# EAGLE design motorsturing_v2 (EAGLE 9.6.2)
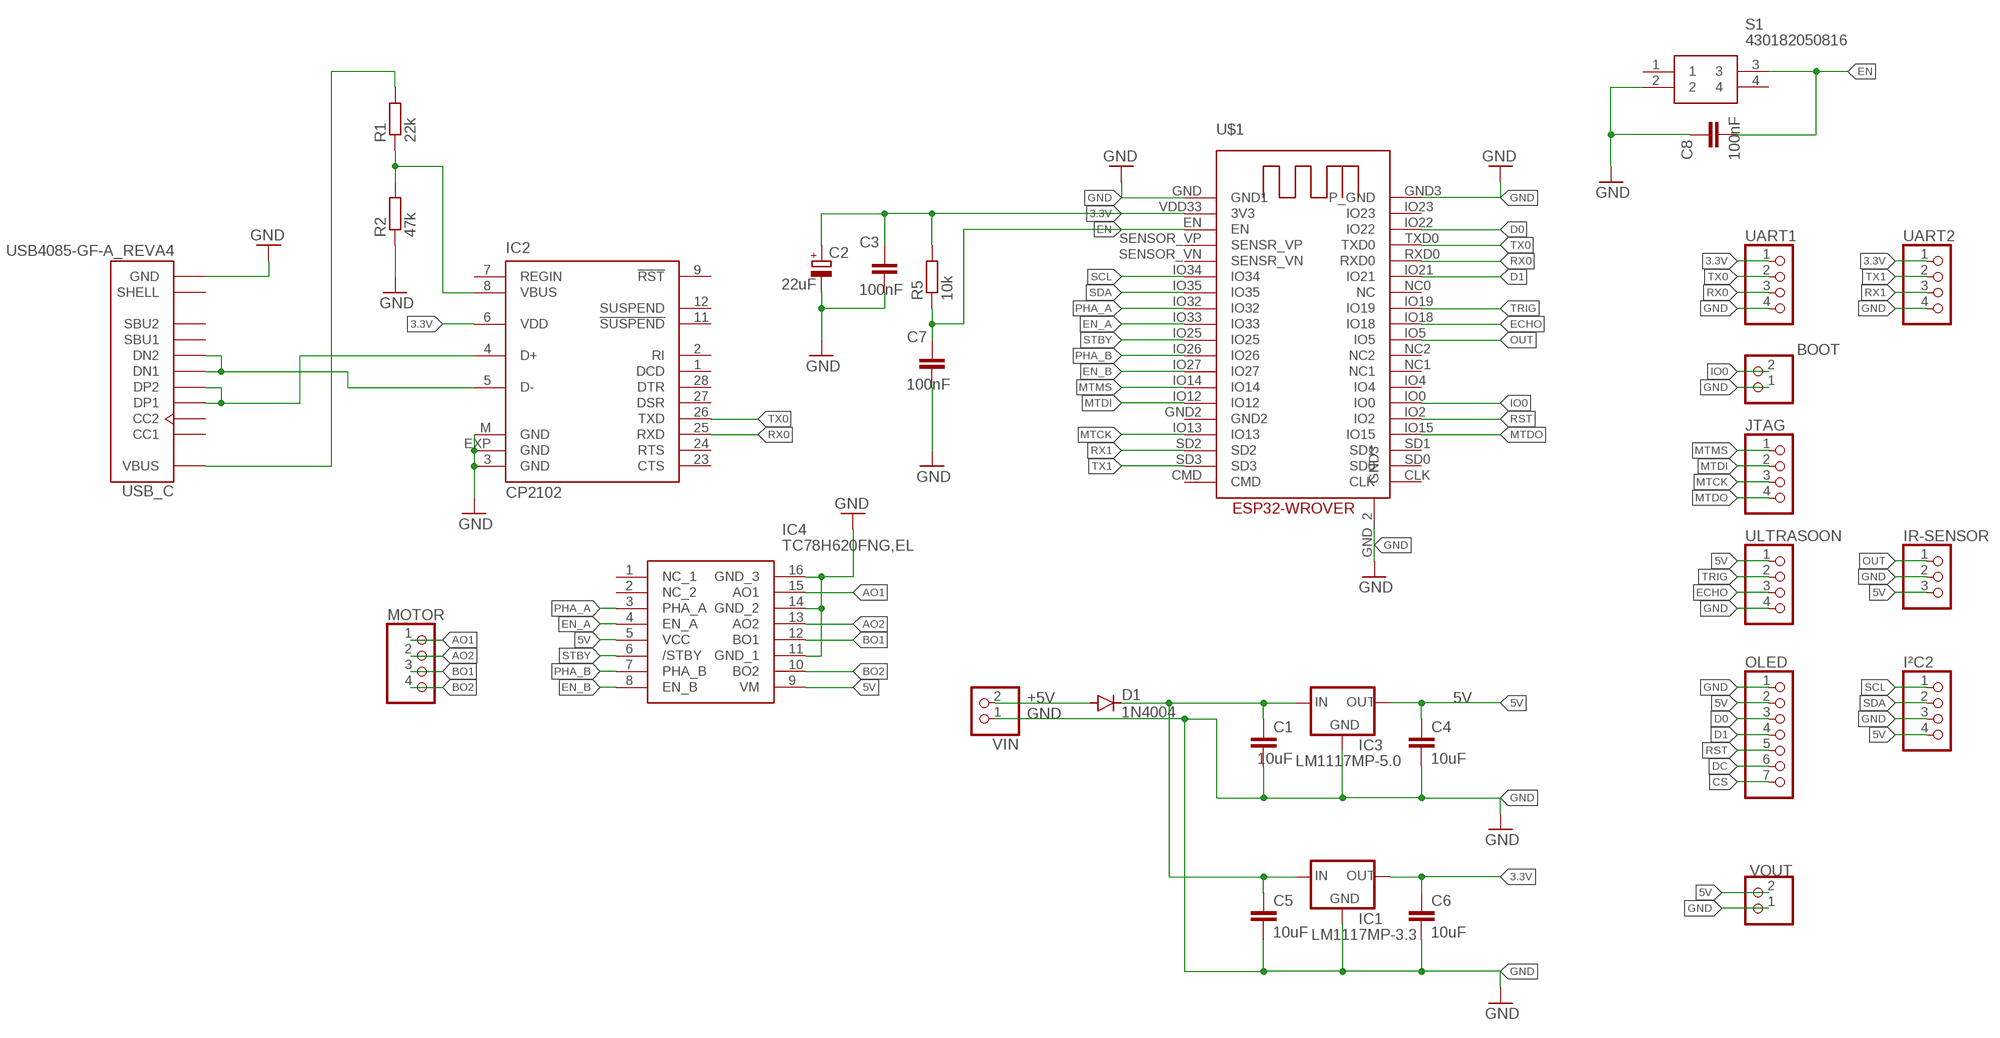
[diagram p0: schematic, sheet 1]

## Parts
BOOT  PINHD-1X2  [1X02]
C1  10uF  C-EUC0603  [C0603]
C2  22uF  CPOL-EUE5-4  [E5-4]
C3  100nF  C-EUC0805  [C0805]
C4  10uF  C-EUC0603  [C0603]
C5  10uF  C-EUC0603  [C0603]
C6  10uF  C-EUC0603  [C0603]
C7  100nF  C-EUC0805  [C0805]
C8  100nF  C-EUC0805  [C0805]
D1  1N4004  [DO41-10]
IC1  LM1117MP-3.3  [SOT223]
IC2  CP2102  [MLP28]
IC3  LM1117MP-5.0  [SOT223]
IC4  TC78H620FNG,EL  [SOP65P640X160-16N]
IR-SENSOR  PINHD-1X3  [1X03]
I²C2  PINHD-1X4  [1X04]
JTAG  PINHD-1X4  [1X04]
MOTOR  PINHD-1X4  [1X04]
OLED  PINHD-1X7  [1X07]
R1  22k  R-EU_M0805  [M0805]
R2  47k  R-EU_M0805  [M0805]
R5  10k  R-EU_M0805  [M0805]
S1  430182050816  [430182070816]
U$1  ESP32-WROVER  [ESP32-WROVER]
UART1  PINHD-1X4  [1X04]
UART2  PINHD-1X4  [1X04]
ULTRASOON  PINHD-1X4  [1X04]
USB_C  USB4085-GF-A_REVA4  [GCT_USB4085-GF-A_REVA4]
VIN  PINHD-1X2  [1X02]
VOUT  PINHD-1X2  [1X02]

## Nets
3.3V: C2.+ C3.2 C6.1 IC1.2(OUT) IC1.4(OUT) IC2.6(VDD) R5.2 U$1.VDD33(3V3) UART1.1 UART2.1
5V: C4.1 IC3.2(OUT) IC3.4(OUT) IC4.5(VCC) IC4.9(VM) IR-SENSOR.3 I²C2.4 OLED.2 ULTRASOON.1 VOUT.2
+5V: C1.1 C5.1 D1.A D1.C IC1.3(IN) IC3.3(IN) VIN.2
AO1: IC4.15(AO1) MOTOR.1
AO2: IC4.13(AO2) MOTOR.2
BO1: IC4.12(BO1) MOTOR.3
BO2: IC4.10(BO2) MOTOR.4
CS: OLED.7
D0: OLED.3 U$1.IO22
D1: OLED.4 U$1.IO21
D+: IC2.4(D+) USB_C.A6(DP1) USB_C.B6(DP2)
D-: IC2.5(D-) USB_C.A7(DN1) USB_C.B7(DN2)
DC: OLED.6
ECHO: U$1.IO18 ULTRASOON.3
EN: C7.2 C8.1 R5.1 S1.3 U$1.EN
EN_A: IC4.4(EN_A) U$1.IO33
EN_B: IC4.8(EN_B) U$1.IO27
GND: BOOT.1 C1.2 C2.- C3.1 C4.2 C5.2 C6.2 C7.1 C8.2 IC1.1(GND) IC2.3(GND) IC2.EXP(GND) IC2.M(GND) IC3.1(GND) IC4.11(GND_1) IC4.14(GND_2) IC4.16(GND_3) IR-SENSOR.2 I²C2.3 OLED.1 R2.1 S1.2 U$1.GND3(P_GND) U$1.GND(GND1) U$1.GND_2(GND3) UART1.4 UART2.4 ULTRASOON.4 USB_C.A1(GND) USB_C.A12(GND) USB_C.B1(GND) USB_C.B12(GND) VIN.1 VOUT.1
IO0: BOOT.2 U$1.IO0
MTCK: JTAG.3 U$1.IO13
MTDI: JTAG.2 U$1.IO12
MTDO: JTAG.4 U$1.IO15
MTMS: JTAG.1 U$1.IO14
OUT: IR-SENSOR.1 U$1.IO5
PHA_A: IC4.3(PHA_A) U$1.IO32
PHA_B: IC4.7(PHA_B) U$1.IO26
RST: OLED.5 U$1.IO2
RX0: IC2.25(RXD) U$1.RXD0 UART1.3
RX1: U$1.SD2 UART2.3
SCL: I²C2.1 U$1.IO34
SDA: I²C2.2 U$1.IO35
STBY: IC4.6(/STBY) U$1.IO25
TRIG: U$1.IO19 ULTRASOON.2
TX0: IC2.26(TXD) U$1.TXD0 UART1.2
TX1: U$1.SD3 UART2.2
VBUS: IC2.8(VBUS) R1.1 R1.2 R2.2 USB_C.A4(VBUS) USB_C.A9(VBUS) USB_C.B4(VBUS) USB_C.B9(VBUS)
Unconnected: IC2.1(DCD) IC2.2(RI) IC2.7(REGIN) IC2.9(!RST) IC2.11(!SUSPEND) IC2.12(SUSPEND) IC2.23(CTS) IC2.24(RTS) IC2.27(DSR) IC2.28(DTR) IC4.1(NC_1) IC4.2(NC_2) S1.1 S1.4 U$1.CLK U$1.CMD U$1.GND2 U$1.IO4 U$1.IO23 U$1.NC0(NC) U$1.NC1 U$1.NC2 U$1.SD0 U$1.SD1 U$1.SENSOR_VN(SENSR_VN) U$1.SENSOR_VP(SENSR_VP) USB_C.A5(CC1) USB_C.A8(SBU1) USB_C.B5(CC2) USB_C.B8(SBU2) USB_C.P1(SHELL) USB_C.P2(SHELL) USB_C.P3(SHELL) USB_C.P4(SHELL)

## Library data of the parts
BOOT VIN VOUT = pinhead:PINHD-1X2: PIN HEADER
C1 C3-C8 = rcl:C-EU: CAPACITOR, European symbol; SPICEPREFIX: C
C2 = rcl:CPOL-EU: POLARIZED CAPACITOR, European symbol; SPICEPREFIX: C
D1 = diode:1N4004: DIODE general purpose rectifier, 1 A
IC1 = lm1117_11:LM1117?-*: 800mA Low-Dropout Linear Regulator Source: http://www.ti.com/lit/ds/symlink/lm1117-n.pdf; MF: Texas Instruments; MPN: LM1117MP-3.3; OC_FARNELL: 9778195; OC_NEWARK: 28X3416
IC2 = silabs:CP210*: Single-Chip USB to UART Bridge Source: www.silabs.com .. CP2101.pdf / cp2102.pdf; MF: FARNELL; MPN: CP2102-GM; OC_FARNELL: 9282130; OC_NEWARK: 30K5635
IC3 = lm1117_11:LM1117?-*: 800mA Low-Dropout Linear Regulator Source: http://www.ti.com/lit/ds/symlink/lm1117-n.pdf; MF: Texas Instruments; MPN: LM1117MP-5.0; OC_FARNELL: 9778209; OC_NEWARK: 28X3417
IC4 = TC78H621FNG:TC78H620FNG,EL: Motor / Motion / Ignition Controllers & Drivers Brush Motor Driver IC 18V 1A Source: Datasheet <https://www.mouser.com/datasheet/2/408/TC78H620FNG_datasheet_en_20161125-1138306.pdf>; ARROW_PART_NUMBER: TC78H620FNG,EL; ARROW_PRICE-STOCK: https://www.arrow.com/en/products/tc78h620fngel/toshiba?region=nac; DESCRIPTION: Motor / Motion / Ignition Controllers & Drivers Brush Motor Driver IC 18V 1A; HEIGHT: 1.6mm; MANUFACTURER_NAME: Toshiba; MANUFACTURER_PART_NUMBER: TC78H620FNG,EL; MOUSER_PART_NUMBER: 757-TC78H620FNGEL; MOUSER_PRICE-STOCK: https://www.mouser.co.uk/ProductDetail/Toshiba/TC78H620FNGEL?qs=gt1LBUVyoHkIiKQSc8wkDw%3D%3D
IR-SENSOR = pinhead:PINHD-1X3: PIN HEADER
I²C2 JTAG MOTOR UART1 UART2 ULTRASOON = pinhead:PINHD-1X4: PIN HEADER
OLED = pinhead:PINHD-1X7: PIN HEADER
R1 R2 R5 = rcl:R-EU_: RESISTOR, European symbol; SPICEPREFIX: R
S1 = push button:430182050816: Black Tactile Tactile Switch, NO 50 mA 1.6mm Surface Mount Source: Datasheet <http://katalog.we-online.de/em/datasheet/4301x2xxx8x6.pdf>; DESCRIPTION: Black Tactile Tactile Switch, NO 50 mA 1.6mm Surface Mount; HEIGHT: mm; MANUFACTURER_NAME: Wurth Elektronik; MANUFACTURER_PART_NUMBER: 430182050816; MOUSER_PART_NUMBER: 710-430182050816; MOUSER_PRICE-STOCK: https://www.mouser.co.uk/ProductDetail/Wurth-Elektronik/430182050816?qs=wr8lucFkNMUyle0jQPgWGw%3D%3D
U$1 = 32teeth - ESP32-WROVER:ESP32-WROVER
USB_C = USB4085-GF-A:USB4085-GF-A_REVA4: USB 2.0 Type C Receptacle Dip Type, PCB Top Mount Check availability <https://pricing.snapeda.com/parts/USB4085-GF-A/Global%20Connector%20Technology/view-part?ref=eda>; AVAILABILITY: In Stock; DESCRIPTION: USB-C (USB TYPE-C) USB 2.0 Receptacle Connector 24 (16+8 Dummy) Position Through Hole, Right Angle, low cost, 3.46mm profile, 16 pin, horizontal, Top mount; MF: Global Connector Technology; MP: USB4085-GF-A; PACKAGE: None; PRICE: None; PURCHASE-URL: https://pricing.snapeda.com/search/part/USB4085-GF-A/?ref=eda

## Board
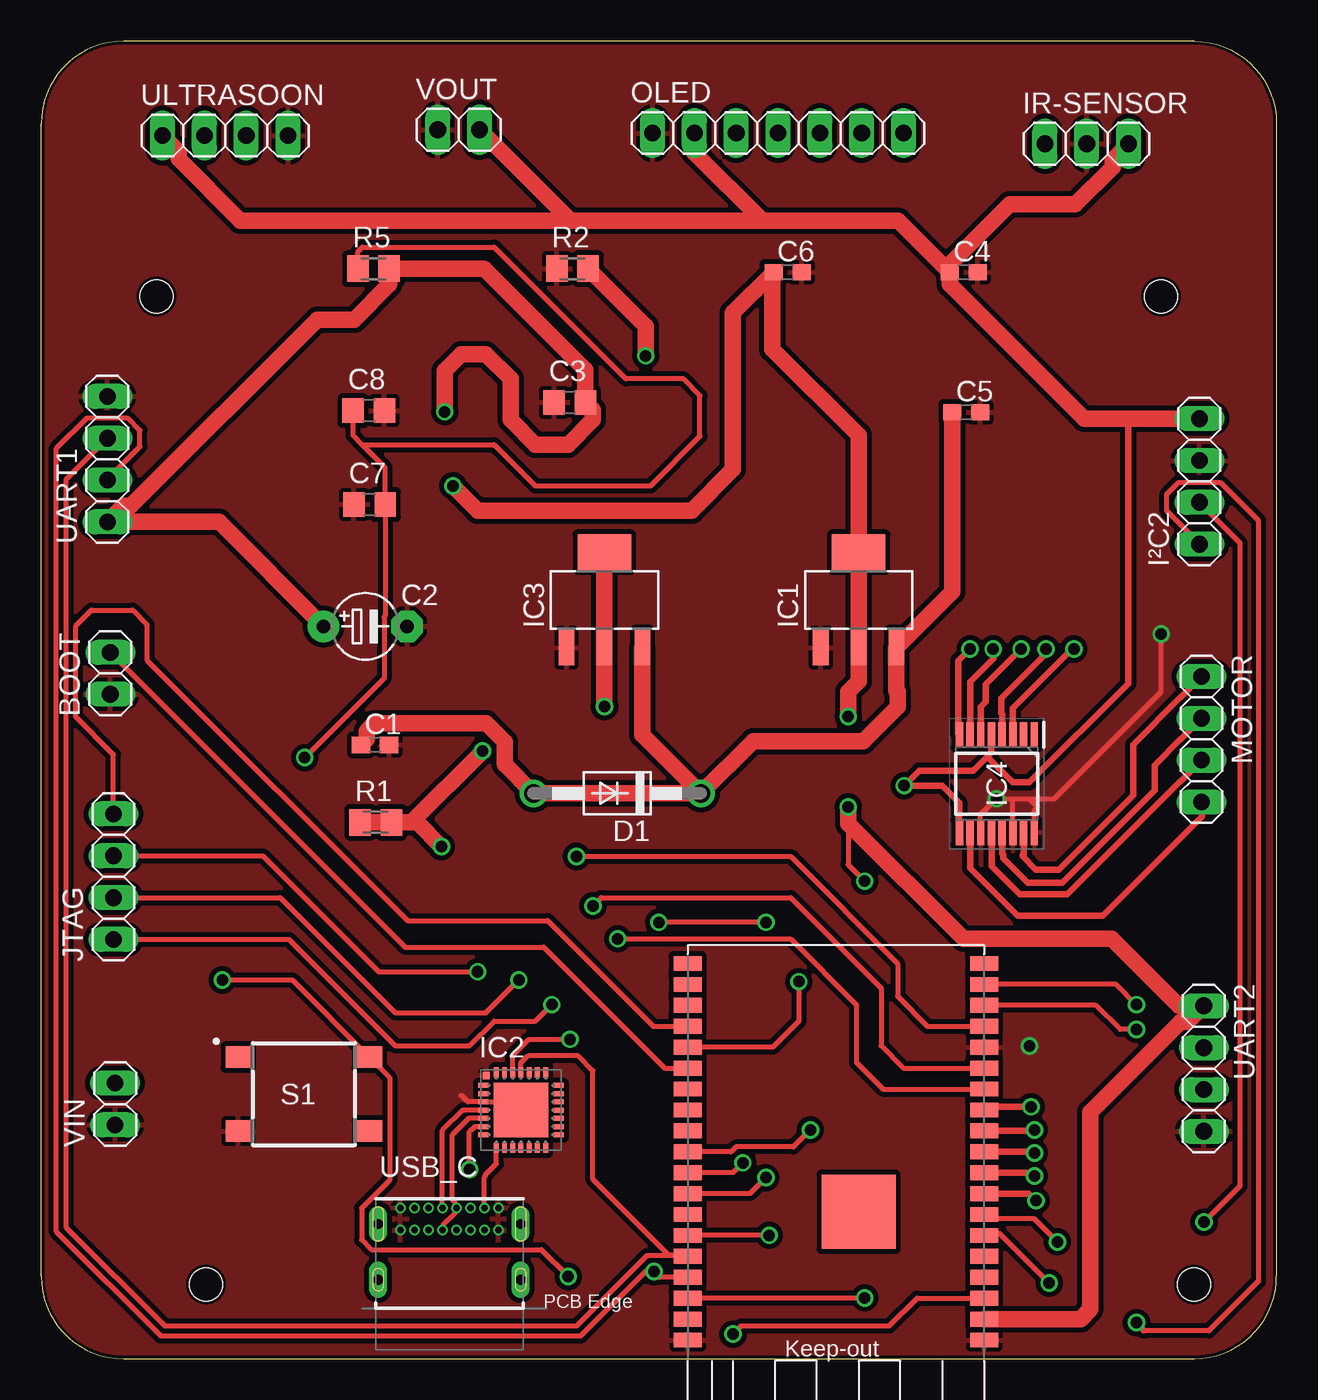
[diagram p1: board, top side]
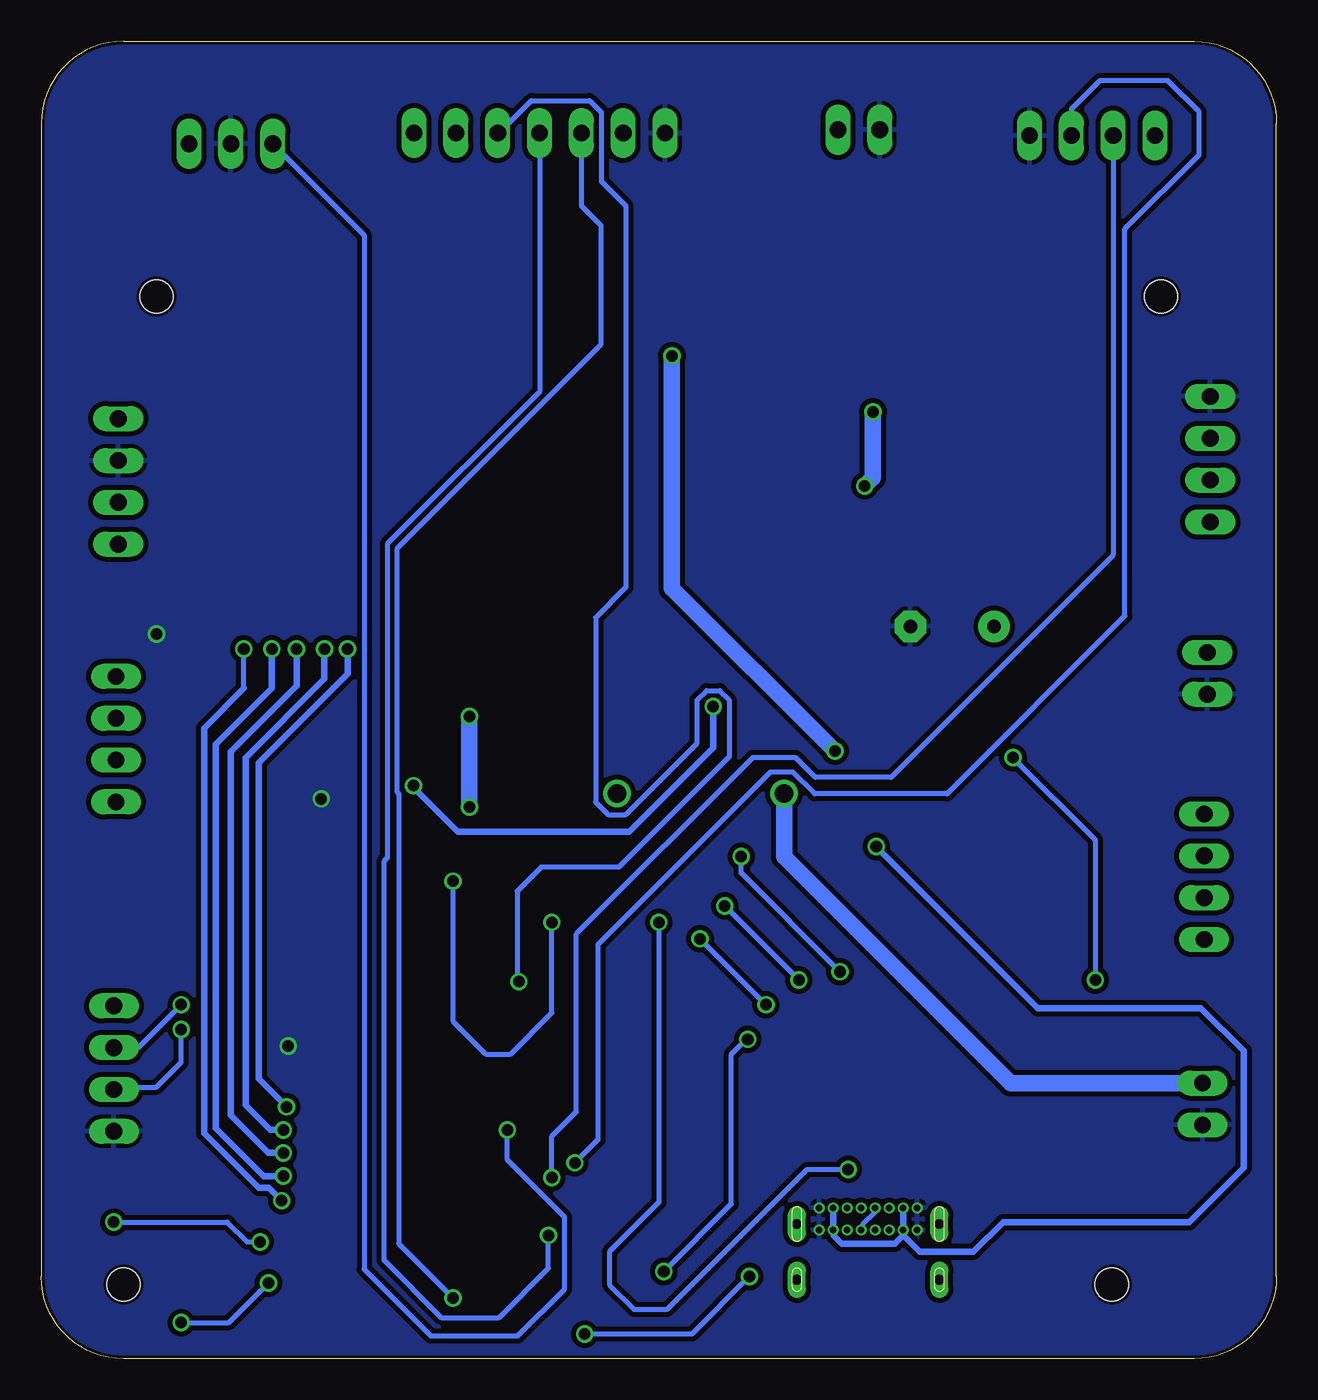
[diagram p2: board, bottom side, seen from below]

Size 75 x 80 mm. Coordinates in mm from the lower left corner, seen from the top.
Outline: 5,0 70,0 arc90 75,5 75,75 arc90 70,80 5,80 arc90 0,75 0,5 arc90 5,0
Copper layers (1*16): Top 0.035mm / dielectric 1.5mm / Bottom 0.035mm
Design rules "default *": minimum track width 0.3mm, minimum drill 0.35mm, track to track 0.3mm, track to pad 0.3mm, pad to pad 0.2mm, via to via 0.3mm, smd to smd 0.2mm, copper to edge 0.2mm, drill to drill 0.3mm, minimum pad ring 0.1mm, minimum via ring 0.1mm, stop-mask expansion 4mil, vias tented up to drill 0mil, thermal gap 10mil
Holes 2 mm at 10,4.5 70,4.5 68,64.5 7,64.5

### Footprints (pad centres in the part's own frame; a part is rotated, then mirrored left to right if it is on the bottom)
1X02 = drill 1.016 long: 1 -1.27,0; 2 1.27,0
C0603 = smd 1.1 x 1: 1 -0.85,0; 2 0.85,0
E5-4 = drill 0.813 pad 1.905: + -2.54,0 | drill 0.813 pad 1.905 octagon: - 2.54,0
C0805 = smd 1.3 x 1.5: 1 -0.95,0; 2 0.95,0
DO41-10 = drill 1.118: A 5.08,0; C -5.08,0
SOT223 = smd 0.95 x 2.15: 1 -2.3,-2.9; 2 0,-2.9; 3 2.3,-2.9 | smd 3.25 x 2.15: 4 0,2.9
MLP28 = smd 0.6 x 0.3: 1 -2.3,1.5; 2 -2.3,1; 3 -2.3,0.5; 4 -2.3,0; 5 -2.3,-0.5; 6 -2.3,-1; 7 -2.3,-1.5; 15 2.3,-1.5; 16 2.3,-1; 17 2.3,-0.5; 18 2.3,0; 19 2.3,0.5; 20 2.3,1; 21 2.3,1.5 | smd 0.3 x 0.6: 8 -1.5,-2.3; 9 -1,-2.3; 10 -0.5,-2.3; 11 0,-2.3; 12 0.5,-2.3; 13 1,-2.3; 14 1.5,-2.3; 22 1.5,2.3; 23 1,2.3; 24 0.5,2.3; 25 0,2.3; 26 -0.5,2.3; 27 -1,2.3; 28 -1.5,2.3 | smd 3.3 x 3.3: EXP 0,0 | smd 0.435 x 0.435: M -2.103,2.103
SOP65P640X160-16N = smd 1.525 x 0.45: 1 -2.962,2.275; 2 -2.962,1.625; 3 -2.962,0.975; 4 -2.962,0.325; 5 -2.962,-0.325; 6 -2.962,-0.975; 7 -2.962,-1.625; 8 -2.962,-2.275; 9 2.962,-2.275; 10 2.962,-1.625; 11 2.962,-0.975; 12 2.962,-0.325; 13 2.962,0.325; 14 2.962,0.975; 15 2.962,1.625; 16 2.962,2.275
1X03 = drill 1.016 long: 1 -2.54,0; 2 0,0; 3 2.54,0
1X04 = drill 1.016 long: 1 -3.81,0; 2 -1.27,0; 3 1.27,0; 4 3.81,0
1X07 = drill 1.016 long: 1 -7.62,0; 2 -5.08,0; 3 -2.54,0; 4 0,0; 5 2.54,0; 6 5.08,0; 7 7.62,0
M0805 = smd 1.3 x 1.6: 1 -0.95,0; 2 0.95,0
430182070816 = smd 1.55 x 1.3: 1 -3.975,2.25; 2 -3.975,-2.25; 3 3.975,2.25; 4 3.975,-2.25
ESP32-WROVER = smd 1.7 x 0.9: CLK 18,1.27; CMD 0,1.27; EN 0,21.59; GND 0,24.13; GND3 18,24.13; GND_2 0,6.35; IO0 18,7.62; IO2 18,6.35; IO4 18,8.89; IO5 18,12.7; IO12 0,7.62; IO13 0,5.08; IO14 0,8.89; IO15 18,5.08; IO18 18,13.97; IO19 18,15.24; IO21 18,17.78; IO22 18,21.59; IO23 18,22.86; IO25 0,12.7; IO26 0,11.43; IO27 0,10.16; IO32 0,15.24; IO33 0,13.97; IO34 0,17.78; IO35 0,16.51; NC0 18,16.51; NC1 18,10.16; NC2 18,11.43; RXD0 18,19.05; SD0 18,2.54; SD1 18,3.81; SD2 0,3.81; SD3 0,2.54; SENSOR_VN 0,19.05; SENSOR_VP 0,20.32; TXD0 18,20.32; VDD33 0,22.86 | smd 4.5 x 4.5: GND2 7.62,16.34
GCT_USB4085-GF-A_REVA4 = drill 0.4 pad 0.65: A1 -2.975,4.025; A4 -2.125,4.025; A5 -1.275,4.025; A6 -0.425,4.025; A7 0.425,4.025; A8 1.275,4.025; A9 2.125,4.025; A12 2.975,4.025; B1 2.975,2.675; B4 2.125,2.675; B5 1.275,2.675; B6 0.425,2.675; B7 -0.425,2.675; B8 -1.275,2.675; B9 -2.125,2.675; B12 -2.975,2.675 | drill 0.6 pad 1.108 long: P1 -4.325,3.045; P2 4.325,3.045; P3 4.325,-0.335; P4 -4.325,-0.335

### Placement (x,y rotation side)
BOOT  4.2,41.62 90 top
C1  20.27,37.27 0 top
C2  19.68,44.47 0 top
C3  32.09,58.07 0 top
C4  56.02,65.97 0 top
C5  56.17,57.47 0 top
C6  45.32,65.97 0 top
C7  19.94,51.87 0 top
C8  19.89,57.57 0 top
D1  34.97,34.33 180 top
IC1  49.63,46.08 0 top
IC2  29.13,15.1 0 top
IC3  34.2,46.08 0 top
IC4  58.02,34.92 270 top
IR-SENSOR  63.48,73.77 0 top
I²C2  70.32,53.27 90 top
JTAG  4.39,29.27 90 top
MOTOR  70.45,37.62 270 top
OLED  44.74,74.42 0 top
R1  20.31,32.57 0 top
R2  32.26,66.19 0 top
R5  20.18,66.19 0 top
S1  15.95,16.07 0 top
U$1  57.25,25.27 180 top
UART1  4.02,54.62 90 top
UART2  70.59,17.62 270 top
ULTRASOON  11.18,74.27 0 top
USB_C  24.79,5.14 0 top
VIN  4.49,15.47 90 top
VOUT  25.35,74.62 0 top

### Tracks (layer width: path | path; a pad name or v marks a point on that pad's centre or on a via)
3.3V  (via drill 0.7 pad 0.95)
  Top 0.3: v49,33.5 49,30 v50,29 | v44,26.5 v37.5,26.5 | v26,11.5 26,13.8 26.08,13.88 26.11,13.88 26.33,14.1 IC2.6
  Top 1.016: C2.+ 10.8,50.81 UART1.1 4.99,51.78 5.43,51.78 16.75,63.1 19,63.1 21.13,65.23 R5.2 26.91,66.19 33.04,60.06 C3.2 33.5,57.61 33.5,57 32,55.5 30,55.5 28.5,57 28.5,59.5 27,61 25.5,61 24.5,60 v24.5,57.5 | U$1.VDD33 63.11,2.41 63.7,3 63.7,14.98 69.18,20.46 69.62,20.46 UART2.1 69.07,21.43 65,25.5 56,25.5 49,32.5 v49,33.5 | v49,39 49,40.5 49.63,41.13 IC1.2 IC1.4 49.63,56.07 44.4,61.3 44.4,65.9 C6.1 42,63.5 42,54 39.5,51.5 26.5,51.5 v25,53
  Bottom 0.3: v50,29 50,20.5 48,18.5 46.5,18.5 44,21 v44,26.5 | v37.5,26.5 37.5,9.5 40.5,6.5 40.5,4.5 39,3 37,3 28.5,11.5 v26,11.5
  Bottom 1.016: v49,33.5 v49,39 | v25,53 24.5,53.5 v24.5,57.5
5V  (via drill 0.7 pad 0.95)
  Top 0.406: 57.45,36.55 56.6,35.7 53.3,35.7 v52.4,34.8 54.7,34.8 55.74,33.76 IC4.9 | 57.45,36.55 57.7,36.8 IC4.5 | 66,57.08 66,41 60,35 58.99,35 57.45,36.55
  Top 1.016: IC3.4 IC3.2 v34.2,39.6 | C4.1 52.04,69.1 43.8,69.1 | 43.8,69.1 39.66,73.24 OLED.2 | I²C2.4 66,57.08 63.32,57.08 55.17,65.23 C4.1 | IR-SENSOR.3 65.05,72.8 65.05,72.36 62.79,70.1 58.8,70.1 55.17,66.47 C4.1 | VOUT.2 32.14,69.1 | 32.14,69.1 43.8,69.1 | ULTRASOON.1 8.34,73.3 8.34,72.86 12.1,69.1 32.14,69.1
  Bottom 0.406: v52.4,34.8 52.4,34.7 49.7,32 39.3,32 34.2,37.1 v34.2,39.6
+5V
  Top 1.016: D1.C 36.5,37.88 IC3.3 | D1.C D1.A 28.13,36.09 28.13,37.45 27.01,38.58 20.23,38.58 19.76,38.1 19.76,37.61 C1.1 | D1.C 43.22,37.5 49.9,37.5 52,39.6 52,40.5 51.93,40.57 IC1.3 55.32,46.57 C5.1
  Bottom 1.016: VIN.2 16.14,16.74 29.89,30.49 D1.A
AO1
  Top 0.406: MOTOR.1 69.17,40.16 69.16,40.16 66.3,37.29 66.3,34.21 61.79,29.7 60.4,29.7 59.6,30.5 59.6,30.6 59.65,30.64 IC4.15
AO2
  Top 0.406: MOTOR.2 69.17,37.62 69.16,37.62 67.6,36.05 67.6,34.51 62,28.91 59.9,28.91 58.41,30.4 58.41,30.6 58.34,30.66 IC4.13
BO1
  Top 0.406: MOTOR.3 69.17,35.08 69.16,35.08 62.29,28.2 59.4,28.2 57.7,29.9 IC4.12
BO2
  Top 0.406: MOTOR.4 70.45,32.91 64.44,26.9 59.3,26.9 56.4,29.8 IC4.10
D0  (via drill 0.7 pad 0.95)
  Top 0.3: v50,3.7 49.98,3.68 U$1.IO22
  Bottom 0.3: OLED.3 42.2,70 41,68.8 41,61.6 53.38,49.23 53.38,34.4 53.3,34.32 53.3,7 v50,3.7
D1  (via drill 0.7 pad 0.95)
  Top 0.3: v44.2,7.5 v44.19,7.49 U$1.IO21
  Bottom 0.3: OLED.4 44.74,58.71 53.98,49.47 53.98,30.43 54.2,30.2 54.2,6 50.7,2.5 47.2,2.5 44.2,5.5 v44.2,7.5
D+
  Top 0.3: USB_C.A6 24.36,13.87 25.6,15.1 IC2.4
  Bottom 0.3: USB_C.B6 25.14,7.89 25.14,8.14 24.36,8.91 USB_C.A6
D-
  Top 0.3: IC2.5 25.95,14.6 24.96,13.62 24.96,9.66 25.14,9.49 25.14,9.24 USB_C.A7 25.14,9.09 25.14,8.84 24.36,8.07 USB_C.B7
ECHO  (via drill 0.7 pad 0.95)
  Top 0.3: v42.6,11.9 42,11.3 U$1.IO18
  Bottom 0.3: ULTRASOON.3 12.45,75.87 10.72,77.6 6.6,77.6 4.7,75.7 4.7,73.1 9.2,68.6 9.2,45.1 20,34.3 28.04,34.3 29.36,35.62 30.72,35.62 41.2,25.14 41.2,13.3 v42.6,11.9
EN  (via drill 0.7 pad 0.95)
  Top 0.3: R5.1 19.23,67.23 19.5,67.5 27.5,67.5 35.5,59.5 39,59.5 40,58.5 40,56 37,53 30,53 27.5,55.5 19.5,55.5 | 19.5,55.5 18.94,56.06 C8.1 | 19.5,55.5 20.89,54.11 C7.2 20.89,45.12 20.82,45.05 20.82,41.32 v16,36.5 | v11,23 15.24,23 S1.3 21.15,17.09 21.15,10.84 19.46,9.15 19.46,7.21 20.05,6.63 30.37,6.63 v32,5 | v42,1.5 42.5,2 51.5,2 53.18,3.68 U$1.EN
  Bottom 0.3: v16,36.5 11,31.5 v11,23 | v32,5 35.5,1.5 v42,1.5
EN_A  (via drill 0.7 pad 0.95)
  Top 0.406: v61,43.1 61,42.8 58.29,40.09 58.29,39.2 58.34,39.15 IC4.4 | v60.3,11.1 60.1,11.3 U$1.IO33
  Bottom 0.406: v60.3,11.1 61.5,11.1 64.4,14 64.4,37.3 61,40.7 v61,43.1
EN_B  (via drill 0.7 pad 0.95)
  Top 0.406: U$1.IO27 57.44,15.3 v60.1,15.3 | v56.4,43.1 55.69,42.39 55.69,37.94 IC4.8
  Bottom 0.406: v60.1,15.3 61.8,17 61.8,36.2 56.4,41.6 v56.4,43.1
GND  (via drill 0.7 pad 0.95)
  Top 0.3: 25.5,16 25.9,15.6 IC2.3 28.63,15.6 IC2.EXP | IC4.11 57,32 57,33 v58,34 | IC4.14 58.99,32.99 | 59,33 58.99,32.99 | IC4.16 60.3,33.3 60.5,33.5 60,34 59,34 | v58,34 59,34 | 58.99,32.99 58.99,33.99 59,34 | v58,34 61.5,34 68,40.5 v68,44
  other vias: 60,19
  pour Top: 0,80 75,80 75,0 0,0
  pour Bottom: 0,80 75,80 75,0 0,0
IO0
  Top 0.3: BOOT.2 22.09,25 30.5,25 37.85,17.65 U$1.IO0
MTCK  (via drill 0.7 pad 0.95)
  Top 0.3: JTAG.3 13.46,30.54 20.5,23.5 v26.5,23.5 | v32.5,30.5 45.5,30.5 52,24 52,22 53.81,20.19 U$1.IO13
  Bottom 0.3: v26.5,23.5 32.5,29.5 v32.5,30.5
MTDI  (via drill 0.7 pad 0.95)
  Top 0.3: JTAG.2 14.5,28 21.5,21 27,21 v29,23 | v33.5,27.5 34,28 45.5,28 51,22.5 51,19 52.35,17.65 U$1.IO12
  Bottom 0.3: v29,23 v33.5,27.5
MTDO
  Top 0.3: JTAG.4 4.39,36.68 2.1,38.97 2.1,44.5 3.05,45.45 5.55,45.45 6.42,44.58 6.42,42.42 22.24,26.6 30.75,26.6 37.16,20.19 U$1.IO15
MTMS  (via drill 0.7 pad 0.95)
  Top 0.3: JTAG.1 15.04,25.46 21.5,19 26,19 27.5,20.5 30,20.5 v31,21.5 | v35,25.5 45.5,25.5 49.5,21.5 49.5,18 51.12,16.38 U$1.IO14
  Bottom 0.3: v31,21.5 v35,25.5
OUT  (via drill 0.7 pad 0.95)
  Top 0.3: U$1.IO5 41.89,12.57 42.2,12.88 45.67,12.88 v46.7,13.9
  Bottom 0.3: IR-SENSOR.1 55.4,68.23 55.4,5.45 51.35,1.4 46.05,1.4 43.23,4.23 43.23,8.6 46.7,12.08 v46.7,13.9
PHA_A  (via drill 0.7 pad 0.95)
  Top 0.406: 57.27,10.05 U$1.IO32 59.97,10.03 v60.4,9.6 | IC4.3 58.99,39.49 62.6,43.1 v62.7,43.1
  Bottom 0.3: 62.7,40.7 v62.7,43.1
  Bottom 0.406: v60.4,9.6 61.19,10.39 61.79,10.39 65.11,13.71 65.11,38.29 62.7,40.7
PHA_B  (via drill 0.7 pad 0.95)
  Top 0.406: v60.3,13.9 60.24,13.84 U$1.IO26 | v57.8,43.1 57.8,42.5 56.4,41.09 IC4.7
  Bottom 0.406: v60.3,13.9 61.1,13.9 62.59,15.39 62.59,36.51 57.8,41.3 v57.8,43.1
RST  (via drill 0.7 pad 0.95)
  Top 0.3: v46,22.9 46,20.5 44.42,18.92 U$1.IO2
  Bottom 0.3: OLED.5 47.22,74.42 45.24,76.39 41.7,76.39 40.99,75.68 40.99,71.49 39.5,70 39.5,46.84 41.34,45 41.34,33.8 40.58,33.04 39.52,33.04 35.17,37.38 35.17,40 34.6,40.58 33.8,40.58 33.23,40 33.23,36.55 39.93,29.85 44.65,29.85 46.1,28.4 46.1,23 v46,22.9
RX0
  Top 0.3: U$1.RXD0 39.17,6.3 39,6.3 | 39,6.3 38.1,6.3 33.5,10.9 33.5,17.5 32.6,18.4 29.54,18.4 29.13,17.99 IC2.25 | UART1.3 1.5,53.37 1.5,8 7.5,2 32.52,2 36.8,6.28 38.98,6.28 39,6.3
RX1  (via drill 0.7 pad 0.95)
  Top 0.3: v66.5,20 65.5,20 64.04,21.46 U$1.SD2
  Bottom 0.3: UART2.3 70.44,16.5 68,16.5 66.5,18 v66.5,20
SCL  (via drill 0.7 pad 0.95)
  Top 0.3: I²C2.1 70.32,49.52 68.35,51.5 68.35,52.5 69.06,53.21 71.58,53.21 73.9,50.9 73.9,4.7 70.9,1.7 67,1.7 | 67,1.7 66.9,1.7 | v61.2,4.6 58.2,7.6 57.36,7.6 U$1.IO34 | 67,1.7 v66.5,2.2
  Bottom 0.3: v66.5,2.2 63.6,2.2 v61.2,4.6
SDA  (via drill 0.7 pad 0.95)
  Top 0.3: I²C2.2 72.8,49.52 72.8,10.5 v70.6,8.3 | v61.7,7.1 60.3,8.5 57.51,8.5 U$1.IO35
  Bottom 0.3: v70.6,8.3 63.7,8.3 62.5,7.1 v61.7,7.1
STBY  (via drill 0.7 pad 0.95)
  Top 0.406: U$1.IO25 60.23,12.57 v60.3,12.5 | IC4.6 57.05,39.59 57.35,39.9 57.35,40.95 v59.5,43.1
  Bottom 0.406: v60.3,12.5 61.2,12.5 63.5,14.8 63.5,36.85 59.47,40.87 59.47,43.07 v59.5,43.1
TRIG  (via drill 0.7 pad 0.95)
  Top 0.3: v44,11 43.03,10.03 U$1.IO19
  Bottom 0.3: ULTRASOON.2 9.91,48.79 23.4,35.3 28,35.3 29.2,36.5 31.8,36.5 42.5,25.8 42.5,15 44,13.5 v44,11
TX0  (via drill 0.7 pad 0.95)
  Top 0.3: U$1.TXD0 37.55,4.95 v37.2,5.3 36.67,5.3 32.77,1.4 7.25,1.4 0.9,7.75 0.9,55.25 2.76,57.1 5.28,57.1 5.99,56.39 5.99,55.39 4.02,53.41 UART1.2 | IC2.26 28.63,18.43 29.6,19.4 v32.1,19.4
  Bottom 0.3: v37.2,5.3 33.1,9.4 33.1,18.5 32.2,19.4 v32.1,19.4
TX1  (via drill 0.7 pad 0.95)
  Top 0.3: U$1.SD3 65.27,22.73 v66.5,21.5
  Bottom 0.3: UART2.2 69.11,18.89 v66.5,21.5
VBUS  (via drill 0.7 pad 0.95)
  Top 0.3: IC2.8 27.63,11.83 26.98,11.18 26.98,11.1 26.91,11.04 USB_C.A9
  Top 1.016: R1.2 R1.1 | R2.2 36.7,62.7 v36.7,60.9 | v26.8,36.9 22.47,32.57 R1.2 | R1.2 22.83,32.57 v24.3,31.1
  Bottom 0.406: v24.3,31.1 14.5,21.3 4.6,21.3 2,18.7 2,11.6 5.3,8.3 16.6,8.3 18.4,6.5 21.67,6.5 22.64,7.47 | 22.64,7.47 22.64,7.79 USB_C.B9 USB_C.A4 | USB_C.A9 USB_C.B4 26.89,7.79 26.89,7.47 26.41,6.99 23.17,6.99 22.69,7.47 22.64,7.47
  Bottom 1.016: v36.7,60.9 36.7,46.8 v26.8,36.9